# EAGLE design splitter_board (EAGLE 7.7.0)
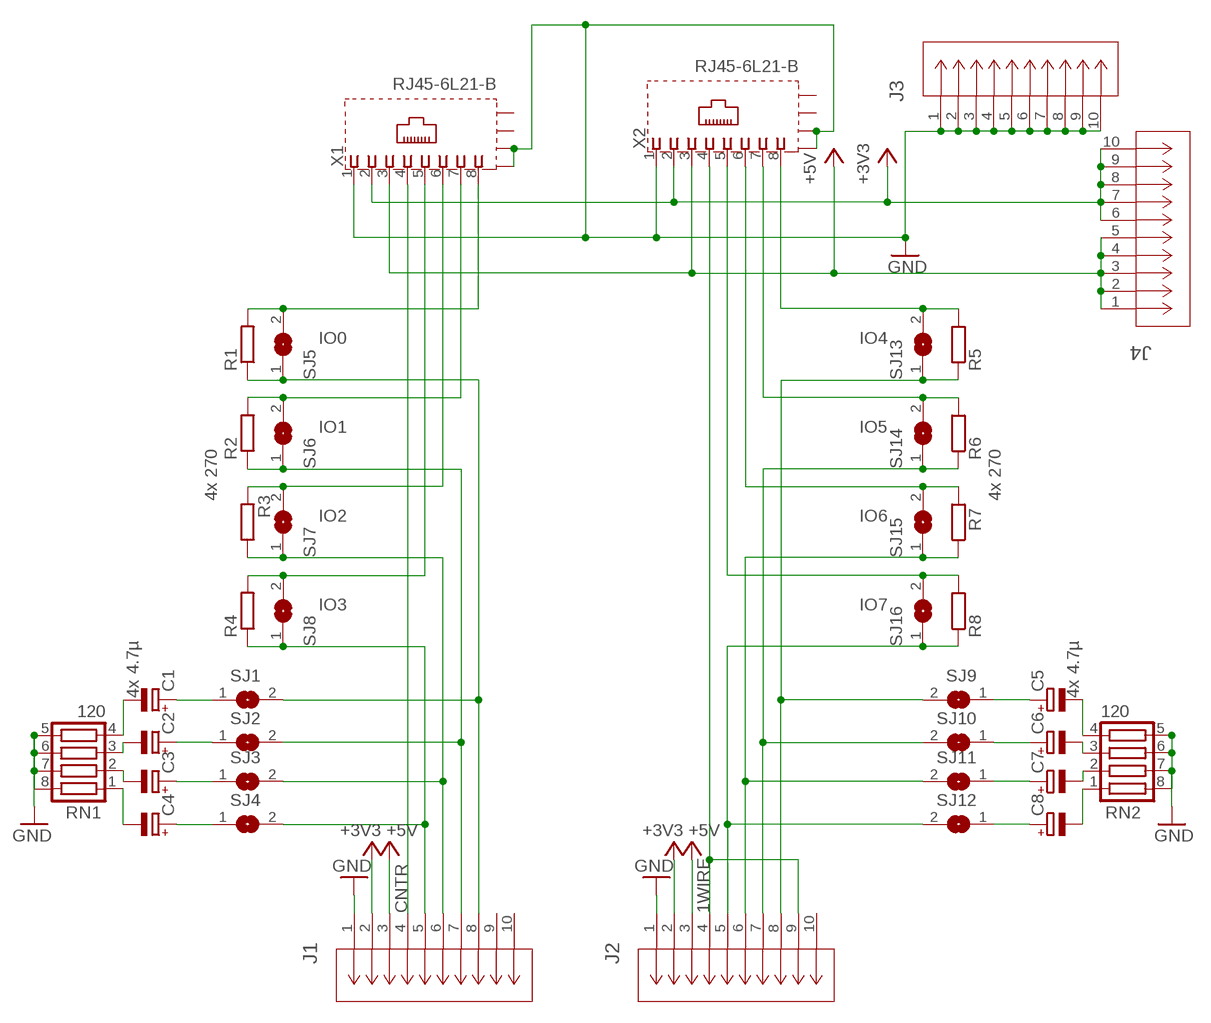
[diagram p0: schematic, sheet 1]

## Parts
C1  4.7µ  CPOL-EUA/3216-18R  [A/3216-18R]
C2  4.7µ  CPOL-EUA/3216-18R  [A/3216-18R]
C3  4.7µ  CPOL-EUA/3216-18R  [A/3216-18R]
C4  4.7µ  CPOL-EUA/3216-18R  [A/3216-18R]
C5  4.7µ  CPOL-EUA/3216-18R  [A/3216-18R]
C6  4.7µ  CPOL-EUA/3216-18R  [A/3216-18R]
C7  4.7µ  CPOL-EUA/3216-18R  [A/3216-18R]
C8  4.7µ  CPOL-EUA/3216-18R  [A/3216-18R]
J1  250-410  [CONN_250-410_WAG]
J2  250-410  [CONN_250-410_WAG]
J3  250-410  [CONN_250-410_WAG]
J4  250-410  [CONN_250-410_WAG]
R1  270  R-EU_R0805  [R0805]
R2  270  R-EU_R0805  [R0805]
R3  270  R-EU_R0805  [R0805]
R4  270  R-EU_R0805  [R0805]
R5  270  R-EU_R0805  [R0805]
R6  270  R-EU_R0805  [R0805]
R7  270  R-EU_R0805  [R0805]
R8  270  R-EU_R0805  [R0805]
RN1  120  CTS742C083  [CTS742C083]
RN2  120  CTS742C083  [CTS742C083]
SJ1  SJ  [SJ]
SJ2  SJ  [SJ]
SJ3  SJ  [SJ]
SJ4  SJ  [SJ]
SJ5  SJ  [SJ]
SJ6  SJ  [SJ]
SJ7  SJ  [SJ]
SJ8  SJ  [SJ]
SJ9  SJ  [SJ]
SJ10  SJ  [SJ]
SJ11  SJ  [SJ]
SJ12  SJ  [SJ]
SJ13  SJ  [SJ]
SJ14  SJ  [SJ]
SJ15  SJ  [SJ]
SJ16  SJ  [SJ]
X1  RJ45-6L21-B  [RJ45-SHIELD1]
X2  RJ45-6L21-B  [RJ45-SHIELD1]

## Nets
1WIRE: J2.4 J2.9 X2.4
+3V3: J1.2 J2.2 J4.6 J4.7 J4.8 J4.9 J4.10 X1.2 X2.2
+5V: J1.3 J2.3 J4.1 J4.2 J4.3 J4.4 J4.5 X1.3 X2.3
CNTR: J1.4 X1.4
GND: J1.1 J2.1 J3.1 J3.2 J3.3 J3.4 J3.5 J3.6 J3.7 J3.8 J3.9 J3.10 RN1.5 RN1.6 RN1.7 RN1.8 RN2.5 RN2.6 RN2.7 RN2.8 X1.1 X1.S1(S) X1.S2(S) X2.1 X2.S1(S) X2.S2(S)
IO0: R1.2 SJ5.2 X1.8
IO1: R2.2 SJ6.2 X1.7
IO2: R3.2 SJ7.2 X1.6
IO3: R4.2 SJ8.2 X1.5
IO4: R5.2 SJ13.2 X2.8
IO5: R6.2 SJ14.2 X2.7
IO6: R7.2 SJ15.2 X2.6
IO7: R8.2 SJ16.2 X2.5
N$1: C8.- RN2.1
N$2: C7.- RN2.2
N$3: C6.- RN2.3
N$4: C5.- RN2.4
N$5: C4.- RN1.1
N$6: C3.- RN1.2
N$7: C2.- RN1.3
N$8: C1.- RN1.4
N$9: C5.+ SJ9.1
N$10: C6.+ SJ10.1
N$11: C7.+ SJ11.1
N$12: C8.+ SJ12.1
N$13: J2.8 R5.1 SJ9.2 SJ13.1
N$14: J2.7 R6.1 SJ10.2 SJ14.1
N$15: J2.6 R7.1 SJ11.2 SJ15.1
N$16: J2.5 R8.1 SJ12.2 SJ16.1
N$19: C1.+ SJ1.1
N$20: C2.+ SJ2.1
N$21: C3.+ SJ3.1
N$22: C4.+ SJ4.1
N$23: J1.7 R2.1 SJ2.2 SJ6.1
N$24: J1.8 R1.1 SJ1.2 SJ5.1
N$26: J1.6 R3.1 SJ3.2 SJ7.1
N$28: J1.5 R4.1 SJ4.2 SJ8.1
Unconnected: J1.9 J1.10 J2.10 X1.S3(S) X1.S4(S) X2.S3(S) X2.S4(S)

## Notes on the sheet
- 4x | 4x
- 4x | 4x

## Library data of the parts
C1-C8 = rcl:CPOL-EU: POLARIZED CAPACITOR, European symbol; JLC: C110309
J1-J4 = con-wago-250-410:250-410; COPYRIGHT: Copyright (C) 2022 Ultra Librarian. All rights reserved.; MANUFACTURER_PART_NUMBER: 250-410; MFR_NAME: Wago
R1-R8 = rcl:R-EU_: RESISTOR, European symbol
RN1 RN2 = resistor-net:CTS742C083: Chip Resistor Array 4 Single Resistor Source: http://www.ctscorp.com/components/Datasheets/CTSChipArrayDs.pdf; OC_FARNELL: unknown; OC_NEWARK: unknown
SJ1-SJ16 = jumper:SJ: SMD solder JUMPER
X1 X2 = con-tycoelectronics:RJ45*2: RJ45 Low Profile Shield Type 2 For all RJ45 L, LC, LCT and X Series Models Source: www.tycoelectronics.com .. ENG_DS_1654001_1099_RJ_L_0507.pdf; OC_FARNELL: unknown; OC_NEWARK: unknown

## Board
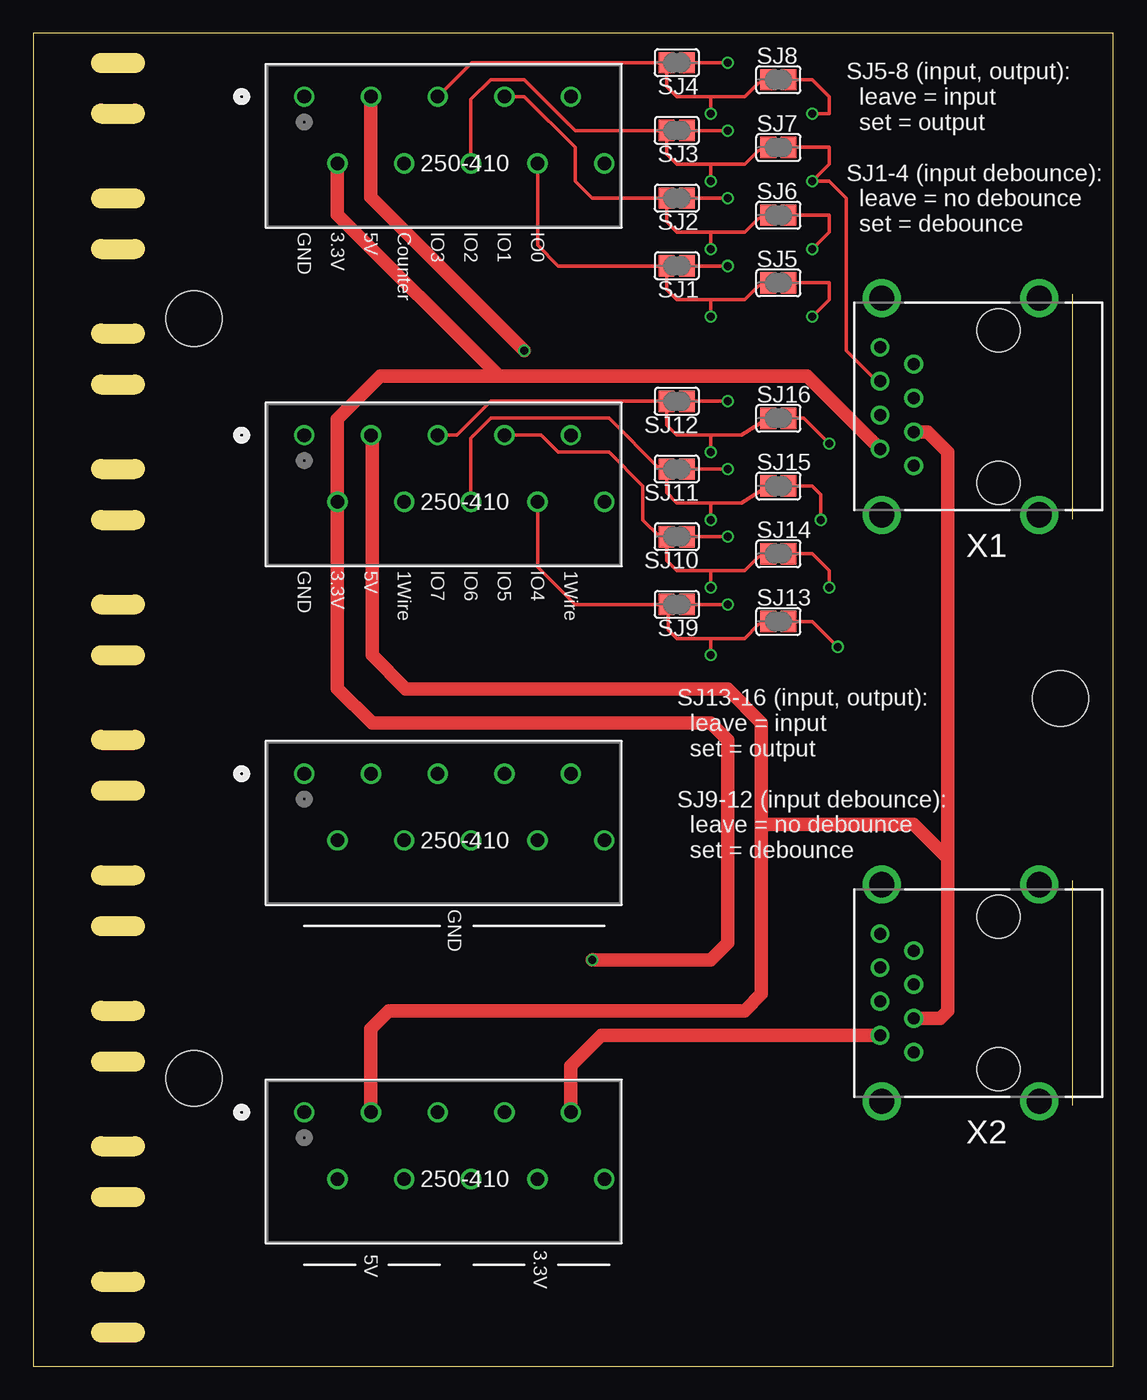
[diagram p1: board, top side]
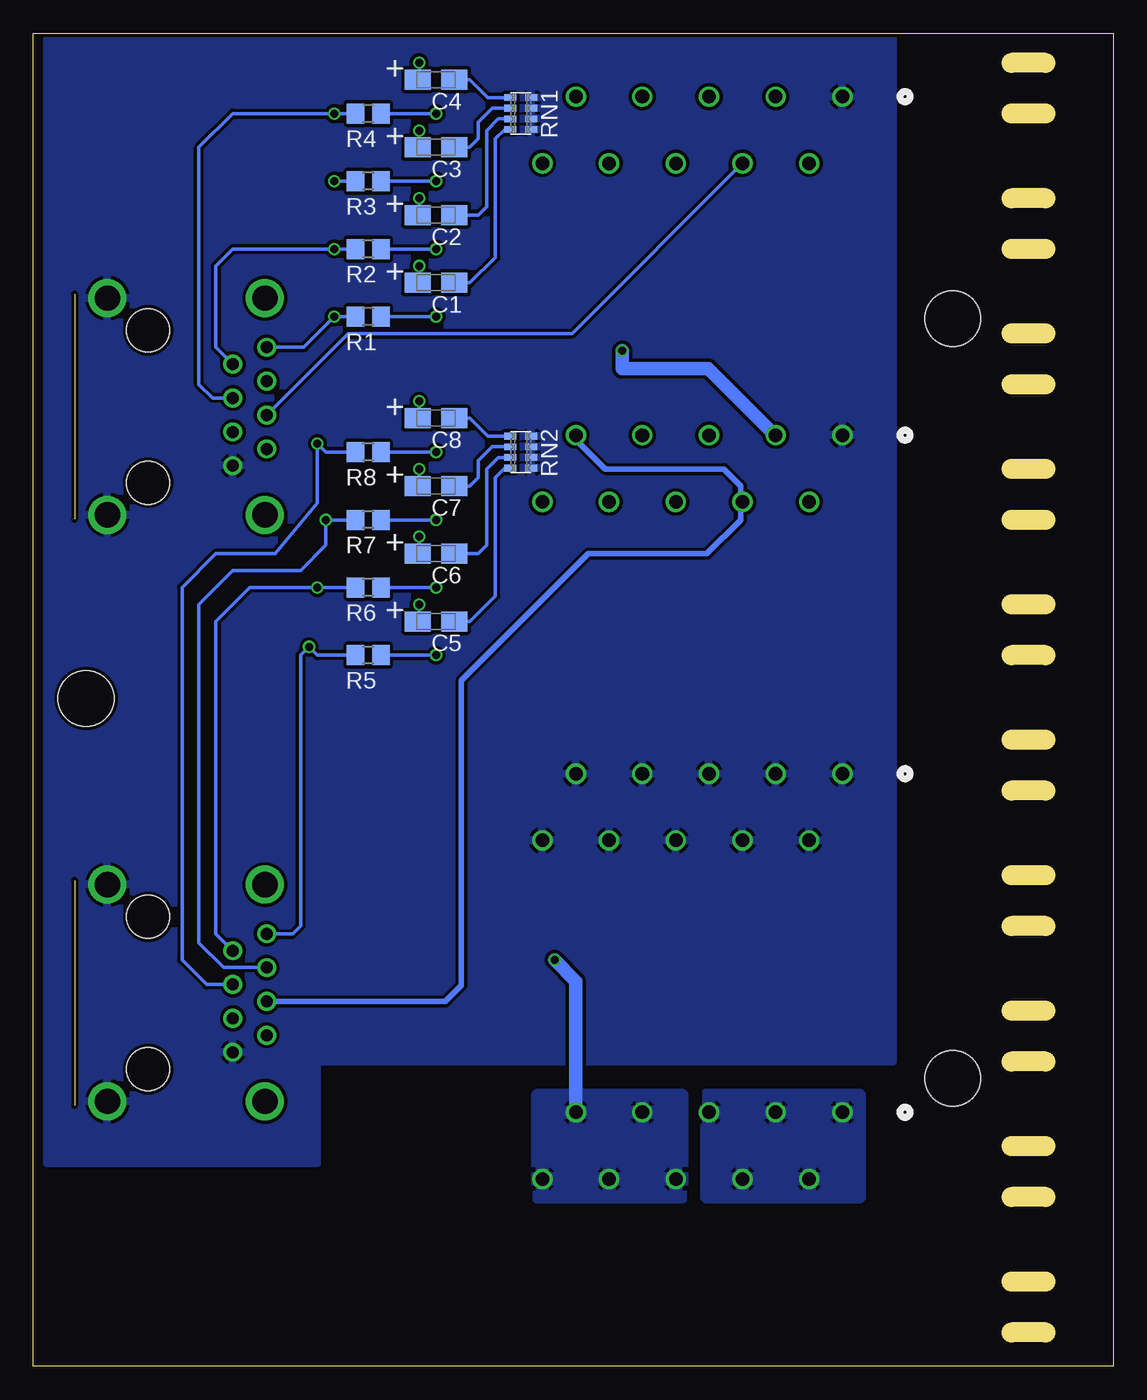
[diagram p2: board, bottom side, seen from below]

Size 81 x 100 mm. Coordinates in mm from the lower left corner, seen from the top.
Outline: 0,0 81,0 81,100 0,100 0,0
Copper layers (1*16): Top 0.035mm / dielectric 1.5mm / Bottom 0.035mm
Design rules "JLCPCB": minimum track width 5mil, minimum drill 12mil, track to track 5mil, track to pad 5mil, pad to pad 5mil, via to via 5mil, smd to smd 0mil, copper to edge 10mil, drill to drill 10mil, minimum pad ring 10mil, minimum via ring 6mil, stop-mask expansion 2mil, vias tented up to drill 25mil, thermal gap 10mil
Holes 4.2 mm at 12.04,21.59 12.04,78.59 77.04,50.09
Milling: 20 lines

### Footprints (pad centres in the part's own frame; a part is rotated, then mirrored left to right if it is on the bottom)
A/3216-18R = smd 1.95 x 1.5: + 1.375,0; - -1.375,0
CONN_250-410_WAG = drill 1.016 pad 1.524: 1 0,0; 2 2.489,-5.004; 3 5.004,0; 4 7.493,-5.004; 5 10.008,0; 6 12.497,-5.004; 7 15.011,0; 8 17.501,-5.004; 9 19.99,0; 10 22.504,-5.004
R0805 = smd 1.3 x 1.5: 1 -0.95,0; 2 0.95,0
CTS742C083 = smd 0.5 x 0.9: 1 -1.2,-0.8; 2 -0.4,-0.8; 3 0.4,-0.8; 4 1.2,-0.8; 5 1.2,0.8; 6 0.4,0.8; 7 -0.4,0.8; 8 -1.2,0.8
SJ = smd 1.168 x 1.6: 1 -0.762,0; 2 0.762,0
RJ45-SHIELD1 = drill 0.9 pad 1.4: 1 -4.445,6.35; 2 -3.175,8.89; 3 -1.905,6.35; 4 -0.635,8.89; 5 0.635,6.35; 6 1.905,8.89; 7 3.175,6.35; 8 4.445,8.89 | drill 1.9 pad 2.5: S1 -8.128,-3.048; S2 8.128,-3.048; S3 -8.128,8.76; S4 8.128,8.76 | hole 3.251: -5.715,0; 5.715,0

### Placement (x,y rotation side)
C1  50.8,81.28 180 bottom
C2  50.8,86.36 180 bottom
C3  50.8,91.44 180 bottom
C4  50.8,96.52 180 bottom
C5  50.8,55.88 180 bottom
C6  50.8,60.96 180 bottom
C7  50.8,66.04 180 bottom
C8  50.8,71.12 180 bottom
J1  20.32,95.25 0 top
J2  20.32,69.85 0 top
J3  20.32,44.45 0 top
J4  20.32,19.05 0 top
R1  55.88,78.74 180 bottom
R2  55.88,83.82 180 bottom
R3  55.88,88.9 180 bottom
R4  55.88,93.98 180 bottom
R5  55.88,53.34 180 bottom
R6  55.88,58.42 180 bottom
R7  55.88,63.5 180 bottom
R8  55.88,68.58 180 bottom
RN1  44.45,93.98 270 bottom
RN2  44.45,68.58 270 bottom
SJ1  48.26,82.55 180 top
SJ2  48.26,87.63 180 top
SJ3  48.26,92.71 180 top
SJ4  48.26,97.79 180 top
SJ5  55.88,81.28 0 top
SJ6  55.88,86.36 0 top
SJ7  55.88,91.44 0 top
SJ8  55.88,96.52 0 top
SJ9  48.26,57.15 180 top
SJ10  48.26,62.23 180 top
SJ11  48.26,67.31 180 top
SJ12  48.26,72.39 180 top
SJ13  55.88,55.88 0 top
SJ14  55.88,60.96 0 top
SJ15  55.88,66.04 0 top
SJ16  55.88,71.12 0 top
X1  72.39,72 90 top
X2  72.39,28 90 top

### Tracks (layer width: path | path; a pad name or v marks a point on that pad's centre or on a via)
1WIRE
  Bottom 0.254: 27.94,64.72 J2.4
  Bottom 0.406: J2.9 40.31,69.52 38.1,67.31 29.21,67.31 27.94,66.04 27.94,64.97 J2.4 | 27.94,64.72 27.94,63.5 30.48,60.96 39.37,60.96 48.9,51.44 48.9,28.57 50.1,27.36 X2.4
+3V3  (via drill 0.6)
  Top 1.016: 34.92,74.3 22.81,86.41 J1.2 | 34.92,74.3 58.03,74.3 X1.2 | 34.92,74.3 26.04,74.3 22.81,71.07 J2.2 22.81,50.85 25.4,48.26 50.8,48.26 52.07,46.99 52.07,31.75 50.8,30.48 v41.91,30.48 | J4.9 40.31,22.53 42.6,24.82 X2.2
  Bottom 1.016: J4.9 40.31,28.88 v41.91,30.48
  pour Bottom: 32.38,20.32 32.38,12.7 43.18,12.7 43.18,20.32
+5V  (via drill 0.6)
  Top 1.016: v36.83,76.2 25.32,87.71 J1.3 | X2.3 68,26.09 68.58,26.67 68.58,38.1 | 68.58,38.1 66.04,40.64 54.61,40.64 | J4.3 25.32,25.32 26.67,26.67 53.34,26.67 54.61,27.94 54.61,40.64 | 54.61,40.64 54.61,48.26 52.07,50.8 27.94,50.8 25.4,53.34 25.4,69.77 J2.3 | 68.58,38.1 68.58,68.58 67.06,70.09 X1.3
  Bottom 1.016: v36.83,76.2 36.83,74.83 30.38,74.83 25.4,69.85 J2.3
  pour Bottom (isolate 0.254): 19.05,20.32 19.05,12.7 30.48,12.7 30.48,20.32
CNTR
  Bottom 0.254: J1.4 40.59,77.47 57.4,77.47 X1.4
GND
  pour Bottom (isolate 0.254): 16.51,100.33 80.01,100.33 80.01,15.24 59.69,15.24 59.69,22.86 16.51,22.86
IO0  (via drill 0.6)
  Top 0.254: v58.42,78.74 59.69,80.01 59.69,81.28 SJ5.2
  Bottom 0.254: X1.8 60.72,76.44 v58.42,78.74 R1.2
IO1  (via drill 0.6)
  Top 0.254: v58.42,83.82 59.69,85.09 59.69,86.36 SJ6.2
  Bottom 0.254: X1.7 67.31,76.44 67.31,82.55 66.04,83.82 v58.42,83.82 R2.2
IO2  (via drill 0.6)
  Top 0.254: X1.6 63.26,73.91 60.96,76.2 60.96,87.63 59.69,88.9 v58.42,88.9 59.69,90.17 59.69,91.44 SJ7.2
  Bottom 0.254: R3.2 v58.42,88.9
IO3  (via drill 0.6)
  Top 0.254: v58.42,93.98 59.69,93.98 59.69,95.25 58.42,96.52 SJ8.2
  Bottom 0.254: X1.5 67.56,72.64 68.58,73.66 68.58,91.44 66.04,93.98 v58.42,93.98 R4.2
IO4  (via drill 0.6)
  Top 0.254: v60.33,53.98 58.42,55.88 SJ13.2
  Bottom 0.254: X2.8 61.53,32.45 60.96,33.02 60.96,53.34 v60.33,53.98 59.69,53.34 R5.2
IO5  (via drill 0.6)
  Top 0.254: v59.69,58.42 59.69,59.69 58.42,60.96 SJ14.2
  Bottom 0.254: X2.7 67.31,32.45 67.31,55.88 64.77,58.42 v59.69,58.42 R6.2
IO6  (via drill 0.6)
  Top 0.254: v59.05,63.5 59.05,65.41 58.42,66.04 SJ15.2
  Bottom 0.254: X2.6 66.73,29.91 68.58,31.75 68.58,57.15 66.04,59.69 60.96,59.69 59.05,61.59 v59.05,63.5 R7.2
IO7  (via drill 0.6)
  Top 0.254: v59.69,69.22 57.78,71.12 SJ16.2
  Bottom 0.254: X2.5 68,28.64 69.85,30.48 69.85,58.42 67.31,60.96 62.87,60.96 59.69,64.77 v59.69,69.22 59.05,68.58 R8.2
N$1
  Bottom 0.254: RN2.1 46.92,69.78 48.26,71.12 C8.-
N$2
  Bottom 0.254: C7.- 48.26,66.04 47.62,66.67 47.62,67.94 46.59,68.98 RN2.2
N$3
  Bottom 0.254: C6.- 47.62,60.96 46.99,61.59 46.99,67.31 46.35,67.94 46.12,68.18 RN2.3
N$4
  Bottom 0.254: C5.- 48.26,55.88 46.35,57.78 46.35,66.67 45.65,67.38 RN2.4
N$5
  Bottom 0.254: RN1.1 46.92,95.18 48.26,96.52 C4.-
N$6
  Bottom 0.254: RN1.2 46.59,94.38 47.62,93.34 47.62,92.08 48.26,91.44 C3.-
N$7
  Bottom 0.254: RN1.3 46.12,93.58 46.99,92.71 46.99,87 47.62,86.36 C2.-
N$8
  Bottom 0.254: C1.- 48.26,81.28 46.35,83.19 46.35,92.08 45.65,92.78 RN1.4
N$9  (via drill 0.6)
  Top 0.254: SJ9.1 v52.07,57.15
  Bottom 0.254: v52.07,57.15 52.07,55.98 C5.+
N$10  (via drill 0.6)
  Top 0.254: SJ10.1 v52.07,62.23
  Bottom 0.254: v52.07,62.23 52.07,61.06 C6.+
N$11  (via drill 0.6)
  Top 0.254: SJ11.1 v52.07,67.31
  Bottom 0.254: v52.07,67.31 52.07,66.14 C7.+
N$12  (via drill 0.6)
  Top 0.254: SJ12.1 v52.07,72.39
  Bottom 0.254: v52.07,72.39 52.07,71.22 C8.+
N$13  (via drill 0.6)
  Top 0.254: SJ13.1 54.36,55.63 53.34,54.61 50.8,54.61 | 50.8,54.61 48.26,54.61 47.62,55.24 47.62,57.02 SJ9.2 40.64,57.15 37.82,59.97 J2.8 | v50.8,53.34 50.8,54.61
  Bottom 0.254: R5.1 v50.8,53.34
N$14  (via drill 0.6)
  Top 0.254: SJ14.1 54.36,60.71 53.34,59.69 50.8,59.69 | 50.8,59.69 48.26,59.69 47.5,60.45 SJ10.2 46.99,62.23 45.72,63.5 45.72,66.04 43.18,68.58 39.37,68.58 38.1,69.85 J2.7 | v50.8,58.42 50.8,59.69
  Bottom 0.254: R6.1 v50.8,58.42
N$15  (via drill 0.6)
  Top 0.254: 50.8,64.77 48.26,64.77 47.5,65.53 SJ11.2 46.99,67.31 43.18,71.12 34.29,71.12 32.82,69.65 J2.6 | 50.8,64.77 53.09,64.77 SJ15.1 | v50.8,63.5 50.8,64.77
  Bottom 0.254: R7.1 v50.8,63.5
N$16  (via drill 0.6)
  Top 0.254: 50.8,69.85 48.26,69.85 47.5,70.61 SJ12.2 34.29,72.39 31.75,69.85 J2.5 | 50.8,69.85 53.09,69.85 SJ16.1 | v50.8,68.58 50.8,69.85
  Bottom 0.254: R8.1 v50.8,68.58
N$19  (via drill 0.6)
  Top 0.254: SJ1.1 v52.07,82.55
  Bottom 0.254: v52.07,82.55 52.07,81.39 C1.+
N$20  (via drill 0.6)
  Top 0.254: SJ2.1 v52.07,87.63
  Bottom 0.254: v52.07,87.63 52.07,86.47 C2.+
N$21  (via drill 0.6)
  Top 0.254: SJ3.1 v52.07,92.71
  Bottom 0.254: v52.07,92.71 52.07,91.55 C3.+
N$22  (via drill 0.6)
  Top 0.254: SJ4.1 v52.07,97.79
  Bottom 0.254: v52.07,97.79 52.07,96.62 C4.+
N$23  (via drill 0.6)
  Top 0.254: SJ6.1 54.36,86.11 53.34,85.09 50.8,85.09 | 50.8,85.09 48.26,85.09 47.5,85.85 SJ2.2 41.91,87.63 40.64,88.9 40.64,91.44 36.83,95.25 J1.7 | v50.8,83.82 50.8,85.09
  Bottom 0.254: R2.1 v50.8,83.82
N$24  (via drill 0.6)
  Top 0.254: SJ5.1 54.36,81.03 53.34,80.01 50.8,80.01 | 50.8,80.01 48.26,80.01 47.5,80.77 SJ1.2 39.37,82.55 37.82,84.1 J1.8 | v50.8,78.74 50.8,80.01
  Bottom 0.254: R1.1 v50.8,78.74
N$26  (via drill 0.6)
  Top 0.254: SJ7.1 54.36,91.19 53.34,90.17 50.8,90.17 | 50.8,90.17 48.26,90.17 47.5,90.93 SJ3.2 40.64,92.71 36.83,96.52 34.29,96.52 32.82,95.05 J1.6 | v50.8,88.9 50.8,90.17
  Bottom 0.254: R3.1 v50.8,88.9
N$28  (via drill 0.6)
  Top 0.254: SJ8.1 54.36,96.27 53.34,95.25 50.8,95.25 | 50.8,95.25 48.26,95.25 47.5,96.01 SJ4.2 32.87,97.79 J1.5 | v50.8,93.98 50.8,95.25
  Bottom 0.254: R4.1 v50.8,93.98

### Text on the board
tNames: GND | 3.3V | 5V | Counter | IO3 | IO2 | IO1 | IO0 | SJ5-8 (input, output): / leave = input / set = output / / SJ1-4 (input debounce): / leave = no debounce / set = debounce | GND | 3.3V | 5V | 1Wire | IO7 | IO6 | IO5 | IO4 | 1Wire | SJ13-16 (input, output): / leave = input / set = output / / SJ9-12 (input debounce): / leave = no debounce / set = debounce | GND | 3.3V | 5V
bNames: + | + | + | + | + | + | + | +